# Altium schematic sheet buoi121.SchDoc
size A3
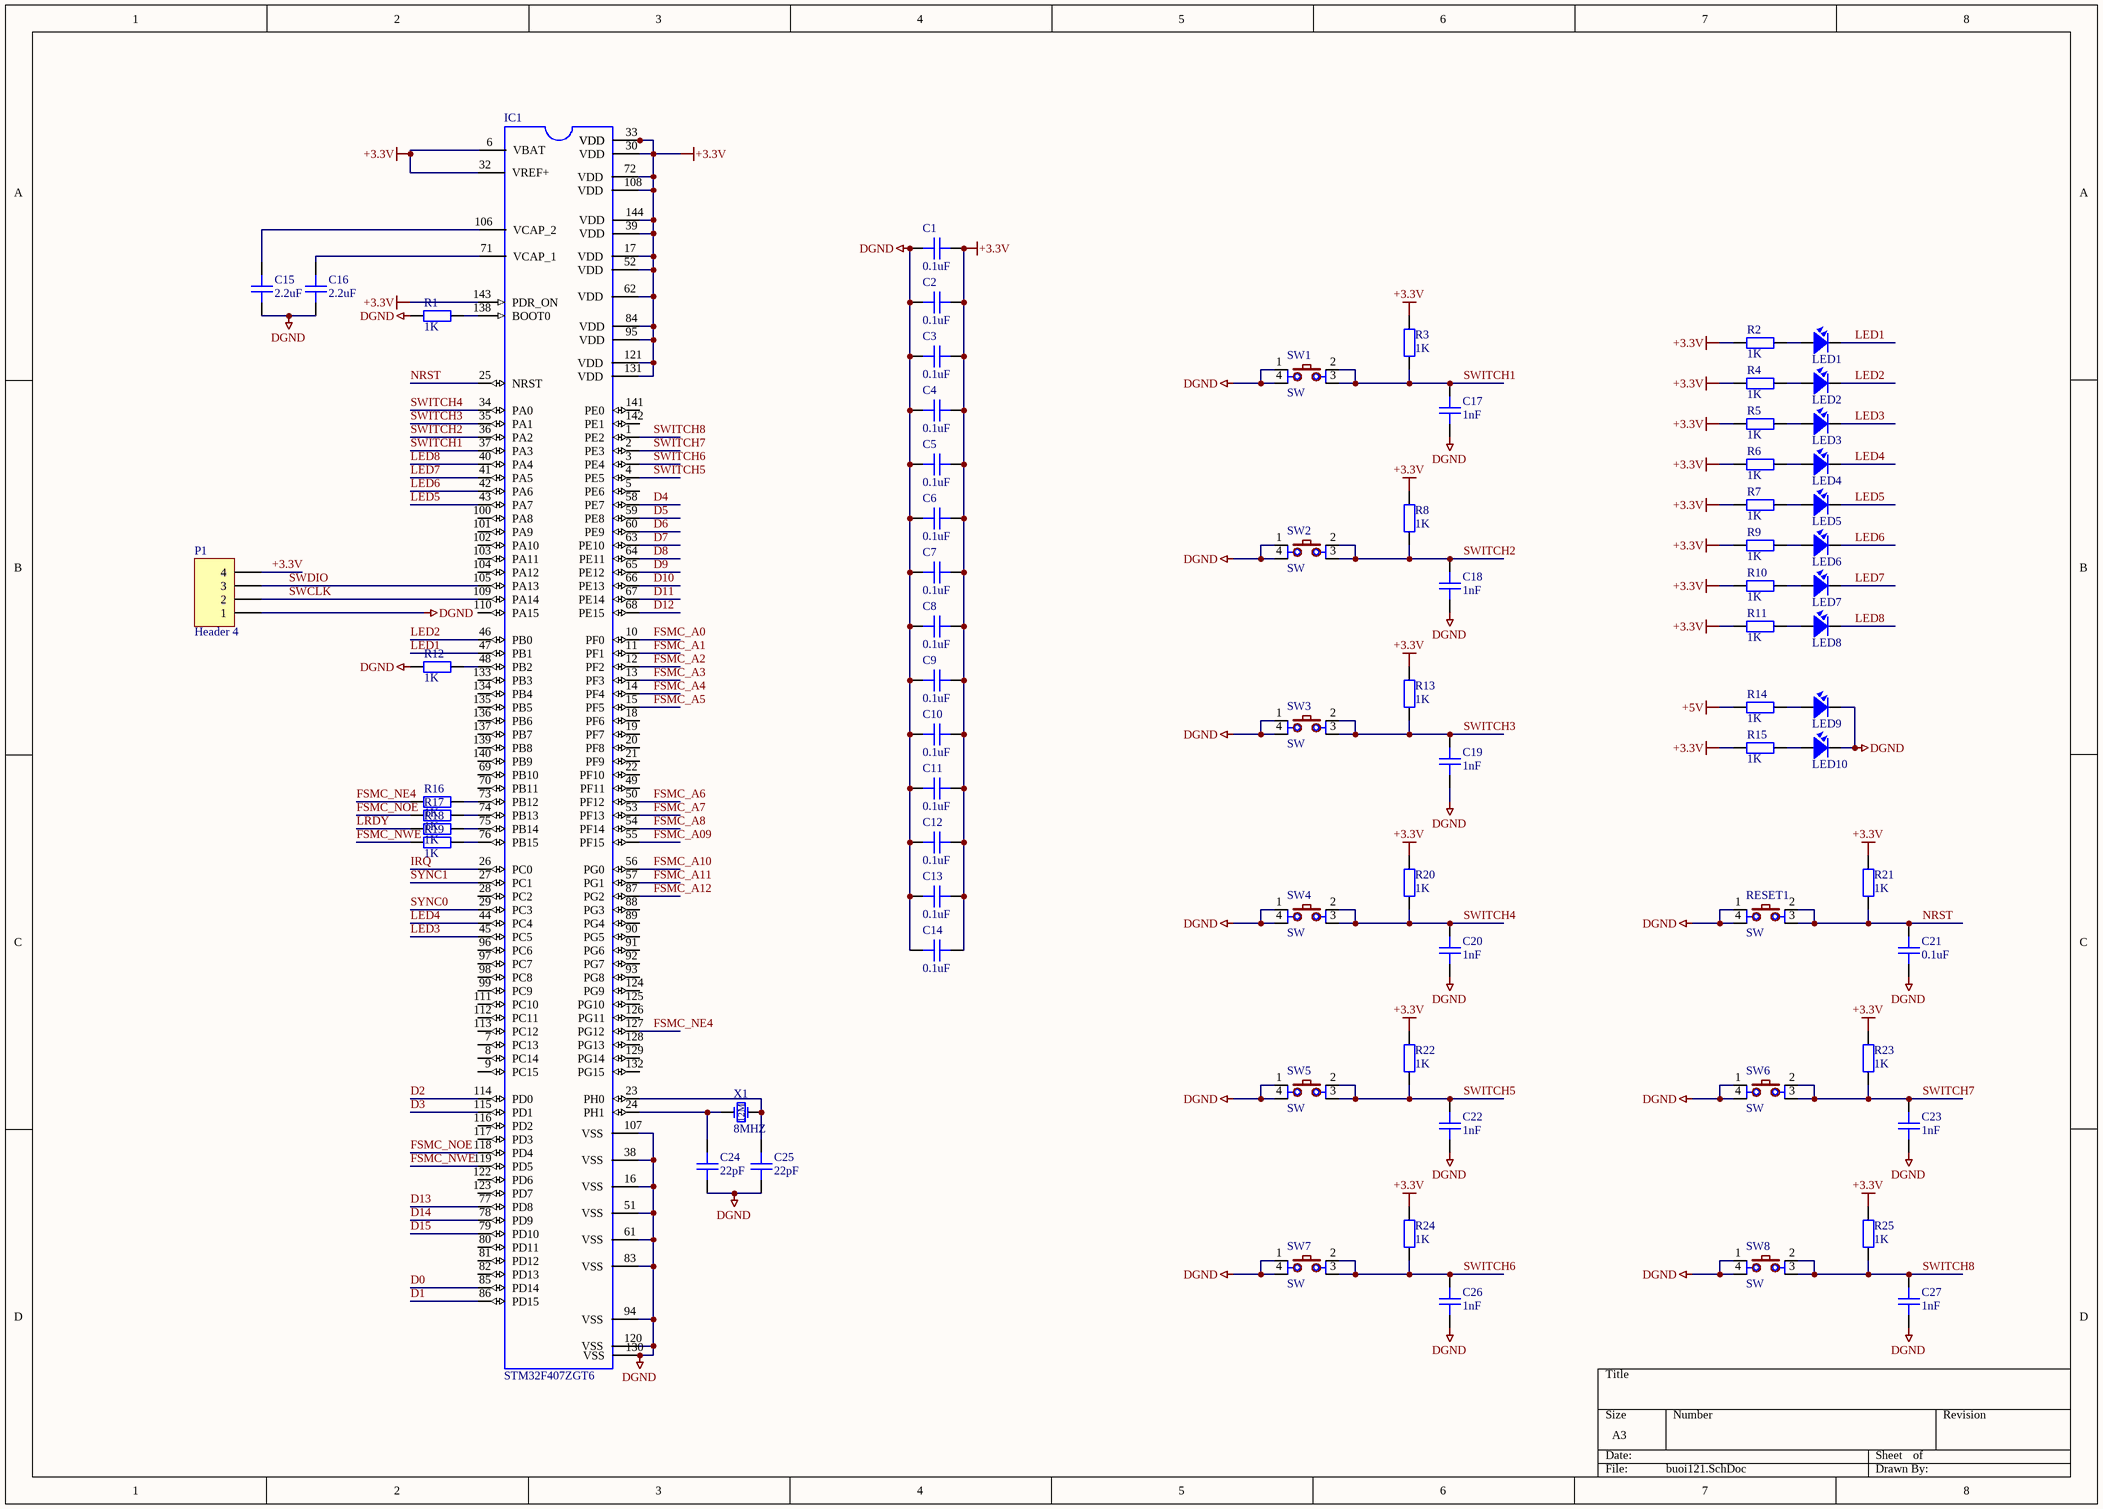
[diagram p0: buoi121.SchDoc]

## Parts
C1  0.1uF  [CAPC-0603 (1608)]
C2  0.1uF  [CAPC-0603 (1608)]
C3  0.1uF  [CAPC-0603 (1608)]
C4  0.1uF  [CAPC-0603 (1608)]
C5  0.1uF  [CAPC-0603 (1608)]
C6  0.1uF  [CAPC-0603 (1608)]
C7  0.1uF  [CAPC-0603 (1608)]
C8  0.1uF  [CAPC-0603 (1608)]
C9  0.1uF  [CAPC-0603 (1608)]
C10  0.1uF  [CAPC-0603 (1608)]
C11  0.1uF  [CAPC-0603 (1608)]
C12  0.1uF  [CAPC-0603 (1608)]
C13  0.1uF  [CAPC-0603 (1608)]
C14  0.1uF  [CAPC-0603 (1608)]
C15  2.2uF  [CAPC-0603 (1608)]
C16  2.2uF  [CAPC-0603 (1608)]
C17  1nF  [CAPC-0603 (1608)]
C18  1nF  [CAPC-0603 (1608)]
C19  1nF  [CAPC-0603 (1608)]
C20  1nF  [CAPC-0603 (1608)]
C21  0.1uF  [CAPC-0603 (1608)]
C22  1nF  [CAPC-0603 (1608)]
C23  1nF  [CAPC-0603 (1608)]
C24  22pF  [CAPC-0603 (1608)]
C25  22pF  [CAPC-0603 (1608)]
C26  1nF  [CAPC-0603 (1608)]
C27  1nF  [CAPC-0603 (1608)]
IC1  STM32F407ZGT6  [PCBComponent_1 - duplicate]
LED1  LED  [LED_0603_BLUE]  (value not drawn)
LED2  LED  [LED_0603_BLUE]  (value not drawn)
LED3  LED  [LED_0603_BLUE]  (value not drawn)
LED4  LED  [LED_0603_BLUE]  (value not drawn)
LED5  LED  [LED_0603_BLUE]  (value not drawn)
LED6  LED  [LED_0603_BLUE]  (value not drawn)
LED7  LED  [LED_0603_BLUE]  (value not drawn)
LED8  LED  [LED_0603_BLUE]  (value not drawn)
LED9  LED  [LED_0603_BLUE]  (value not drawn)
LED10  LED  [LED_0603_BLUE]  (value not drawn)
P1  Header 4  [HDR1X4]
R1  1K  [RESC-0603 (1608)]
R2  1K  [RESC-0603 (1608)]
R3  1K  [RESC-0603 (1608)]
R4  1K  [RESC-0603 (1608)]
R5  1K  [RESC-0603 (1608)]
R6  1K  [RESC-0603 (1608)]
R7  1K  [RESC-0603 (1608)]
R8  1K  [RESC-0603 (1608)]
R9  1K  [RESC-0603 (1608)]
R10  1K  [RESC-0603 (1608)]
R11  1K  [RESC-0603 (1608)]
R12  1K  [RESC-0603 (1608)]
R13  1K  [RESC-0603 (1608)]
R14  1K  [RESC-0603 (1608)]
R15  1K  [RESC-0603 (1608)]
R16  1K  [RESC-0603 (1608)]
R17  1K  [RESC-0603 (1608)]
R18  1K  [RESC-0603 (1608)]
R19  1K  [RESC-0603 (1608)]
R20  1K  [RESC-0603 (1608)]
R21  1K  [RESC-0603 (1608)]
R22  1K  [RESC-0603 (1608)]
R23  1K  [RESC-0603 (1608)]
R24  1K  [RESC-0603 (1608)]
R25  1K  [RESC-0603 (1608)]
RESET1  SW  [SW2-SMD]
SW1  SW  [SW2-SMD]
SW2  SW  [SW2-SMD]
SW3  SW  [SW2-SMD]
SW4  SW  [SW2-SMD]
SW5  SW  [SW2-SMD]
SW6  SW  [SW2-SMD]
SW7  SW  [SW2-SMD]
SW8  SW  [SW2-SMD]
X1  8MHZ  [CRYSTAL_ABM3 5x3.2mm]

## Nets
+3.3V: C1.2 C2.2 C3.2 C4.2 C5.2 C6.2 C7.2 C8.2 C9.2 C10.2 C11.2 C12.2 C13.2 C14.2 IC1.6(VBAT) IC1.17(VDD) IC1.30(VDD) IC1.32(VREF+) IC1.33(VDD) IC1.39(VDD) IC1.52(VDD) IC1.62(VDD) IC1.72(VDD) IC1.84(VDD) IC1.95(VDD) IC1.108(VDD) IC1.121(VDD) IC1.131(VDD) IC1.143(PDR_ON) IC1.144(VDD) P1.4 R2.2 R3.1 R4.2 R5.2 R6.2 R7.2 R8.1 R9.2 R10.2 R11.2 R13.1 R15.2 R20.1 R21.1 R22.1 R23.1 R24.1 R25.1
+5V: R14.2
DGND: C1.1 C2.1 C3.1 C4.1 C5.1 C6.1 C7.1 C8.1 C9.1 C10.1 C11.1 C12.1 C13.1 C14.1 C15.1 C16.1 C17.1 C18.1 C19.1 C20.1 C21.1 C22.1 C23.1 C24.1 C25.1 C26.1 C27.1 IC1.16(VSS) IC1.38(VSS) IC1.51(VSS) IC1.61(VSS) IC1.83(VSS) IC1.94(VSS) IC1.107(VSS) IC1.120(VSS) IC1.130(VSS) LED9.2 LED10.2 P1.1 R1.1 R12.1 RESET1.1 RESET1.4 SW1.1 SW1.4 SW2.1 SW2.4 SW3.1 SW3.4 SW4.1 SW4.4 SW5.1 SW5.4 SW6.1 SW6.4 SW7.1 SW7.4 SW8.1 SW8.4
D0: IC1.85(PD14)
D1: IC1.86(PD15)
D2: IC1.114(PD0)
D3: IC1.115(PD1)
D4: IC1.58(PE7)
D5: IC1.59(PE8)
D6: IC1.60(PE9)
D7: IC1.63(PE10)
D8: IC1.64(PE11)
D9: IC1.65(PE12)
D10: IC1.66(PE13)
D11: IC1.67(PE14)
D12: IC1.68(PE15)
D13: IC1.77(PD8)
D14: IC1.78(PD9)
D15: IC1.79(PD10)
FSMC_A0: IC1.10(PF0)
FSMC_A1: IC1.11(PF1)
FSMC_A2: IC1.12(PF2)
FSMC_A3: IC1.13(PF3)
FSMC_A4: IC1.14(PF4)
FSMC_A5: IC1.15(PF5)
FSMC_A6: IC1.50(PF12)
FSMC_A7: IC1.53(PF13)
FSMC_A8: IC1.54(PF14)
FSMC_A09: IC1.55(PF15)
FSMC_A10: IC1.56(PG0)
FSMC_A11: IC1.57(PG1)
FSMC_A12: IC1.87(PG2)
FSMC_NE4: IC1.127(PG12) R16.1
FSMC_NOE: IC1.118(PD4) R17.1
FSMC_NWE: IC1.119(PD5) R19.1
IRQ: IC1.26(PC0)
LED1: IC1.47(PB1) LED1.2
LED2: IC1.46(PB0) LED2.2
LED3: IC1.45(PC5) LED3.2
LED4: IC1.44(PC4) LED4.2
LED5: IC1.43(PA7) LED5.2
LED6: IC1.42(PA6) LED6.2
LED7: IC1.41(PA5) LED7.2
LED8: IC1.40(PA4) LED8.2
LRDY: R18.1
NRST: C21.2 IC1.25(NRST) R21.2 RESET1.2 RESET1.3
SWCLK: IC1.109(PA14) P1.2
SWDIO: IC1.105(PA13) P1.3
SWITCH1: C17.2 IC1.37(PA3) R3.2 SW1.2 SW1.3
SWITCH2: C18.2 IC1.36(PA2) R8.2 SW2.2 SW2.3
SWITCH3: C19.2 IC1.35(PA1) R13.2 SW3.2 SW3.3
SWITCH4: C20.2 IC1.34(PA0) R20.2 SW4.2 SW4.3
SWITCH5: C22.2 IC1.4(PE5) R22.2 SW5.2 SW5.3
SWITCH6: C26.2 IC1.3(PE4) R24.2 SW7.2 SW7.3
SWITCH7: C23.2 IC1.2(PE3) R23.2 SW6.2 SW6.3
SWITCH8: C27.2 IC1.1(PE2) R25.2 SW8.2 SW8.3
SYNC0: IC1.29(PC3)
SYNC1: IC1.27(PC1)
NetC15_2: C15.2 IC1.106(VCAP_2)
NetC16_2: C16.2 IC1.71(VCAP_1)
NetC24_2: C24.2 IC1.24(PH1) X1.1(OSC1)
NetC25_2: C25.2 IC1.23(PH0) X1.2(OSC2)
NetIC1_48: IC1.48(PB2) R12.2
NetIC1_73: IC1.73(PB12) R16.2
NetIC1_74: IC1.74(PB13) R17.2
NetIC1_75: IC1.75(PB14) R18.2
NetIC1_76: IC1.76(PB15) R19.2
NetIC1_138: IC1.138(BOOT0) R1.2
NetLED1_1: LED1.1 R2.1
NetLED2_1: LED2.1 R4.1
NetLED3_1: LED3.1 R5.1
NetLED4_1: LED4.1 R6.1
NetLED5_1: LED5.1 R7.1
NetLED6_1: LED6.1 R9.1
NetLED7_1: LED7.1 R10.1
NetLED8_1: LED8.1 R11.1
NetLED9_1: LED9.1 R14.1
NetLED10_1: LED10.1 R15.1

Not connected (* = marked no-connect by the designer): IC1 5(PE6) 7(PC13) 8(PC14) 9(PC15) 18(PF6) 19(PF7) 20(PF8) 21(PF9) 22(PF10) 28(PC2) 49(PF11) 69(PB10) 70(PB11) 80(PD11) 81(PD12) 82(PD13) 88(PG3) 89(PG4) 90(PG5) 91(PG6) 92(PG7) 93(PG8) 96(PC6) 97(PC7) 98(PC8) 99(PC9) 100(PA8) 101(PA9) 102(PA10) 103(PA11) 104(PA12) 110(PA15) 111(PC10) 112(PC11) 113(PC12) 116(PD2) 117(PD3) 122(PD6) 123(PD7) 124(PG9) 125(PG10) 126(PG11) 128(PG13) 129(PG14) 132(PG15) 133(PB3) 134(PB4) 135(PB5) 136(PB6) 137(PB7) 139(PB8) 140(PB9) 141(PE0) 142(PE1)

## Notes on the sheet
- (in symbol ABM3-12.000MHZ-D2Y-T) 12M

## Library data of the parts
C1-C27 = C0603C104K5RACTU: CAP CER 0.1uF 50V 10% X7R 0603; CompanyID: VT-00982; Solder: SMT; Value: 104/50V; MPN: C0603C104K5RACTU; Category: CAPACITOR; PinCount: 2
IC1 = STM32
LED1-LED10 = LED SMD: Value: LED 3 - 5 ly 2 Colour
P1 = Header 4: Header, 4-Pin; LatestRevisionDate: 17-Jul-2002; LatestRevisionNote: Re-released for DXP Platform.; Publisher: Altium Limited
R1-R25 = CRCW06032K20FKEA: RES SMD 2.2K OHM 1% 1/10W 0603; CompanyID: VT-00776; Solder: SMT; Value: 2K2; MPN: CRCW06032K20FKEA; Category: RESISTOR
RESET1 SW1-SW8 = SW4: Switch button 4 pin; Value: Button chip 4 pin
X1 = ABM3-12.000MHZ-D2Y-T: CRYSTAL 25.0000MHZ 18pF SMD; Solder: SMT; CompanyID: VT-01247; Value: 12MHz; MPN: ABM3-12.000MHZ-D2Y-T; Category: CRYSTAL